# Altium schematic sheet DifferentialToSingle.SchDoc
size A4; CompanyName: Technische Hochschule Nürnberg Georg Simon Ohm; Address1: Fürther Straße 250; Address2: 90429 Nürnberg; Address3: GERMANY; DocumentNumber: 8; SheetNumber: 8; SheetTotal: 16; CompanyName2: Institut ELSYS
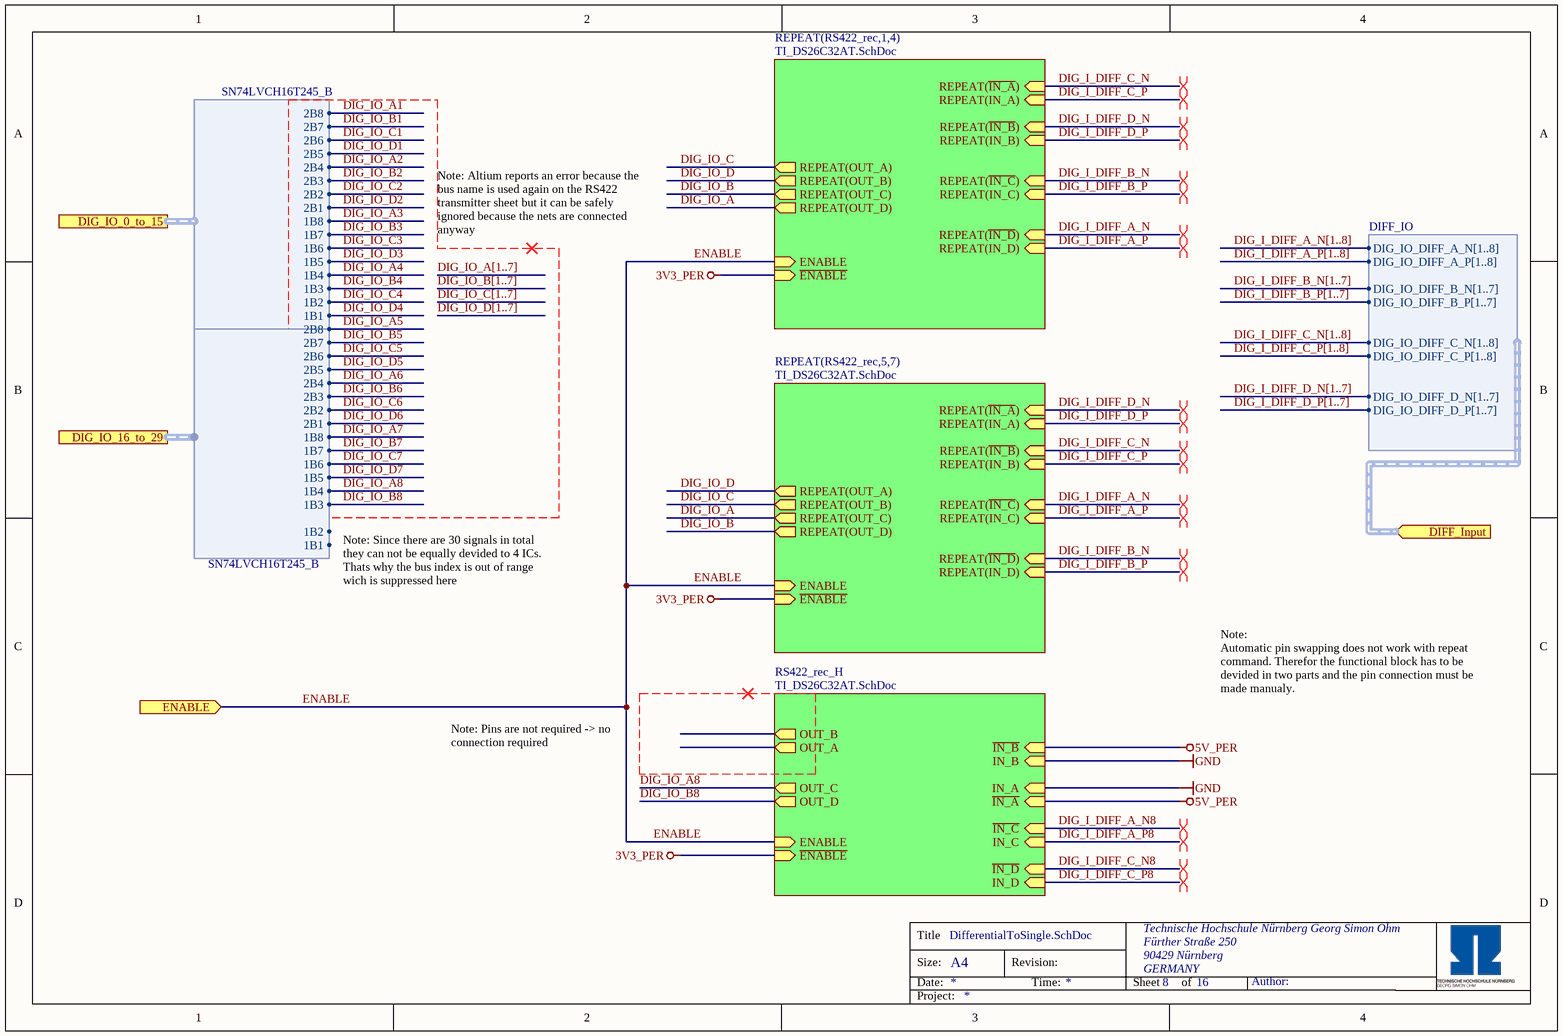
[diagram p0: DifferentialToSingle.SchDoc]

## Sub-sheets
REPEAT(RS422_rec,1,4) = TI_DS26C32AT.SchDoc: REPEAT(~{IN_A}) (in), REPEAT(IN_A) (in), REPEAT(~{IN_B}) (in), REPEAT(IN_B) (in), REPEAT(IN_C) (in), REPEAT(~{IN_D}) (in), REPEAT(IN_D) (in), REPEAT(OUT_A) (out), REPEAT(OUT_D) (out), REPEAT(OUT_B) (out), REPEAT(OUT_C) (out), ENABLE (in), ~{ENABLE} (in), REPEAT(~{IN_C}) (in)
REPEAT(RS422_rec,5,7) = TI_DS26C32AT.SchDoc: REPEAT(~{IN_A}) (in), REPEAT(IN_A) (in), REPEAT(~{IN_B}) (in), REPEAT(IN_B) (in), REPEAT(IN_C) (in), REPEAT(~{IN_C}) (in), REPEAT(~{IN_D}) (in), REPEAT(IN_D) (in), REPEAT(OUT_A) (out), REPEAT(OUT_D) (out), REPEAT(OUT_B) (out), REPEAT(OUT_C) (out), ENABLE (in), ~{ENABLE} (in)
RS422_rec_H = TI_DS26C32AT.SchDoc: OUT_C (out), OUT_D (out), ENABLE (in), ~{ENABLE} (in), ~{IN_D} (in), IN_D (in), ~{IN_C} (in), IN_C (in), IN_A (in), ~{IN_A} (in), ~{IN_B} (in), IN_B (in), OUT_B (out), OUT_A (out)

## Ports
DIFF_Input (in, harness DIFF_IO), DIG_IO_0_to_15 (harness SN74LVCH16T245_B), DIG_IO_16_to_29 (harness SN74LVCH16T245_B), ENABLE (in)

## Harnesses
DIFF_IO: DIG_IO_DIFF_A_N[1..8], DIG_IO_DIFF_A_P[1..8], DIG_IO_DIFF_B_N[1..7], DIG_IO_DIFF_B_P[1..7], DIG_IO_DIFF_C_N[1..8], DIG_IO_DIFF_C_P[1..8], DIG_IO_DIFF_D_N[1..7], DIG_IO_DIFF_D_P[1..7]
SN74LVCH16T245_B: 1B1, 1B2, 1B3, 1B4, 1B5, 1B6, 1B7, 1B8, 2B1, 2B2, 2B3, 2B4, 2B5, 2B6, 2B7, 2B8

## Nets
3V3_PER: sheet RS422_rec_H/~{ENABLE}, sheet REPEAT(RS422_rec,1,4)/~{ENABLE}, sheet REPEAT(RS422_rec,5,7)/~{ENABLE}
5V_PER: sheet RS422_rec_H/~{IN_A}, sheet RS422_rec_H/~{IN_B}
GND: sheet RS422_rec_H/IN_A, sheet RS422_rec_H/IN_B
DIG_I_DIFF_A_N: sheet REPEAT(RS422_rec,1,4)/REPEAT(~{IN_D}), sheet REPEAT(RS422_rec,5,7)/REPEAT(~{IN_C})
DIG_I_DIFF_A_N8: sheet RS422_rec_H/~{IN_C}
DIG_I_DIFF_A_P: sheet REPEAT(RS422_rec,1,4)/REPEAT(IN_D), sheet REPEAT(RS422_rec,5,7)/REPEAT(IN_C)
DIG_I_DIFF_A_P8: sheet RS422_rec_H/IN_C
DIG_I_DIFF_B_N: sheet REPEAT(RS422_rec,1,4)/REPEAT(~{IN_C}), sheet REPEAT(RS422_rec,5,7)/REPEAT(~{IN_D})
DIG_I_DIFF_B_P: sheet REPEAT(RS422_rec,1,4)/REPEAT(IN_C), sheet REPEAT(RS422_rec,5,7)/REPEAT(IN_D)
DIG_I_DIFF_C_N: sheet REPEAT(RS422_rec,1,4)/REPEAT(~{IN_A}), sheet REPEAT(RS422_rec,5,7)/REPEAT(~{IN_B})
DIG_I_DIFF_C_N8: sheet RS422_rec_H/~{IN_D}
DIG_I_DIFF_C_P: sheet REPEAT(RS422_rec,1,4)/REPEAT(IN_A), sheet REPEAT(RS422_rec,5,7)/REPEAT(IN_B)
DIG_I_DIFF_C_P8: sheet RS422_rec_H/IN_D
DIG_I_DIFF_D_N: sheet REPEAT(RS422_rec,1,4)/REPEAT(~{IN_B}), sheet REPEAT(RS422_rec,5,7)/REPEAT(~{IN_A})
DIG_I_DIFF_D_P: sheet REPEAT(RS422_rec,1,4)/REPEAT(IN_B), sheet REPEAT(RS422_rec,5,7)/REPEAT(IN_A)
DIG_IO_A: sheet REPEAT(RS422_rec,1,4)/REPEAT(OUT_D), sheet REPEAT(RS422_rec,5,7)/REPEAT(OUT_C)
DIG_IO_A1: port DIG_IO_0_to_15.2B8
DIG_IO_A2: port DIG_IO_0_to_15.2B4
DIG_IO_A3: port DIG_IO_0_to_15.1B8
DIG_IO_A4: port DIG_IO_0_to_15.1B4
DIG_IO_A5: port DIG_IO_16_to_29.2B8
DIG_IO_A6: port DIG_IO_16_to_29.2B4
DIG_IO_A7: port DIG_IO_16_to_29.1B8
DIG_IO_A8: sheet RS422_rec_H/OUT_C, port DIG_IO_16_to_29.1B4
DIG_IO_B: sheet REPEAT(RS422_rec,1,4)/REPEAT(OUT_C), sheet REPEAT(RS422_rec,5,7)/REPEAT(OUT_D)
DIG_IO_B1: port DIG_IO_0_to_15.2B7
DIG_IO_B2: port DIG_IO_0_to_15.2B3
DIG_IO_B3: port DIG_IO_0_to_15.1B7
DIG_IO_B4: port DIG_IO_0_to_15.1B3
DIG_IO_B5: port DIG_IO_16_to_29.2B7
DIG_IO_B6: port DIG_IO_16_to_29.2B3
DIG_IO_B7: port DIG_IO_16_to_29.1B7
DIG_IO_B8: sheet RS422_rec_H/OUT_D, port DIG_IO_16_to_29.1B3
DIG_IO_C: sheet REPEAT(RS422_rec,1,4)/REPEAT(OUT_A), sheet REPEAT(RS422_rec,5,7)/REPEAT(OUT_B)
DIG_IO_C1: port DIG_IO_0_to_15.2B6
DIG_IO_C2: port DIG_IO_0_to_15.2B2
DIG_IO_C3: port DIG_IO_0_to_15.1B6
DIG_IO_C4: port DIG_IO_0_to_15.1B2
DIG_IO_C5: port DIG_IO_16_to_29.2B6
DIG_IO_C6: port DIG_IO_16_to_29.2B2
DIG_IO_C7: port DIG_IO_16_to_29.1B6
DIG_IO_D: sheet REPEAT(RS422_rec,1,4)/REPEAT(OUT_B), sheet REPEAT(RS422_rec,5,7)/REPEAT(OUT_A)
DIG_IO_D1: port DIG_IO_0_to_15.2B5
DIG_IO_D2: port DIG_IO_0_to_15.2B1
DIG_IO_D3: port DIG_IO_0_to_15.1B5
DIG_IO_D4: port DIG_IO_0_to_15.1B1
DIG_IO_D5: port DIG_IO_16_to_29.2B5
DIG_IO_D6: port DIG_IO_16_to_29.2B1
DIG_IO_D7: port DIG_IO_16_to_29.1B5
ENABLE: port ENABLE, sheet RS422_rec_H/ENABLE, sheet REPEAT(RS422_rec,1,4)/ENABLE, sheet REPEAT(RS422_rec,5,7)/ENABLE

## Buses and harness runs
bus DIG_I_DIFF_A_N[1..8]
bus DIG_I_DIFF_A_P[1..8]
bus DIG_I_DIFF_B_N[1..7]
bus DIG_I_DIFF_B_P[1..7]
bus DIG_I_DIFF_C_N[1..8]
bus DIG_I_DIFF_C_P[1..8]
bus DIG_I_DIFF_D_N[1..7]
bus DIG_I_DIFF_D_P[1..7]
bus DIG_IO_A[1..7]
bus DIG_IO_B[1..7]
bus DIG_IO_C[1..7]
bus DIG_IO_D[1..7]

## Layout directives
differential pair: DIG_I_DIFF_A_N, DIG_I_DIFF_A_N8, DIG_I_DIFF_A_P, DIG_I_DIFF_A_P8, DIG_I_DIFF_B_N, DIG_I_DIFF_B_P, DIG_I_DIFF_C_N, DIG_I_DIFF_C_N8, DIG_I_DIFF_C_P, DIG_I_DIFF_C_P8, DIG_I_DIFF_D_N, DIG_I_DIFF_D_P

## Notes on the sheet
- Note: Altium reports an error because the bus name is used again on the RS422 transmitter sheet but it can be safely ignored because the nets are connected anyway
- Note: Since there are 30 signals in total they can not be equally devided to 4 ICs. Thats why the bus index is out of range wich is suppressed here
- Note:
  Automatic pin swapping does not work with repeat command. Therefor the functional block has to be devided in two parts and the pin connection must be made manualy.
- Note: Pins are not required -> no connection required
- Title
- Size:
- Date:
- A4
- Revision:
- Time:
- Sheet
- of
- Author:
- Project: